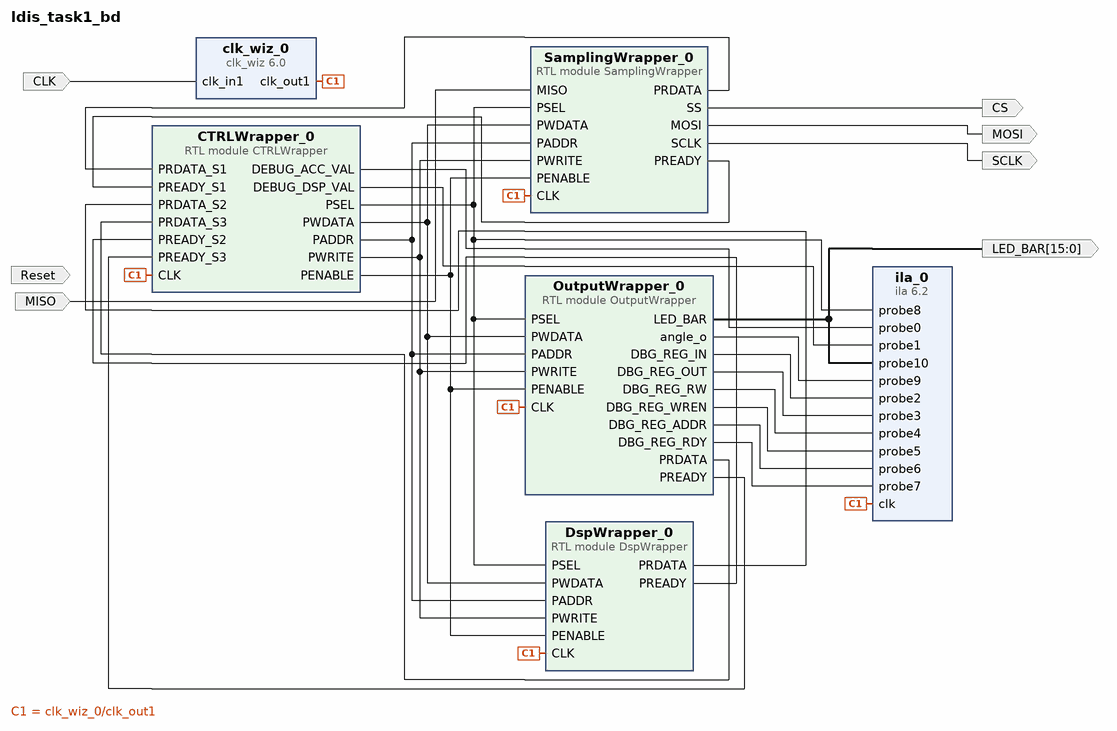
[diagram p0: block diagram of the top level]
# Vivado block design ldis_task1_bd, xc7a100tcsg324-1, Vivado 2018.3
create_bd_design ldis_task1_bd

create_bd_port -dir I -type clk CLK
create_bd_port -dir O MOSI
create_bd_port -dir I MISO
create_bd_port -dir O SCLK
create_bd_port -dir I -type rst Reset
create_bd_port -dir O -type data CS
create_bd_port -dir O -from 15 -to 0 -type data LED_BAR

create_bd_cell -type ip -vlnv xilinx.com:ip:clk_wiz:6.0 clk_wiz_0
set_property -dict [list \
  CONFIG.CLKIN2_JITTER_PS 112.49000000000001 \
  CONFIG.CLKOUT1_DRIVES BUFGCE \
  CONFIG.CLKOUT1_JITTER 203.457 \
  CONFIG.CLKOUT1_PHASE_ERROR 155.540 \
  CONFIG.CLKOUT1_REQUESTED_OUT_FREQ 50 \
  CONFIG.CLKOUT2_DRIVES BUFGCE \
  CONFIG.CLKOUT3_DRIVES BUFGCE \
  CONFIG.CLKOUT4_DRIVES BUFGCE \
  CONFIG.CLKOUT5_DRIVES BUFGCE \
  CONFIG.CLKOUT6_DRIVES BUFGCE \
  CONFIG.CLKOUT7_DRIVES BUFGCE \
  CONFIG.CLK_IN1_BOARD_INTERFACE sys_clock \
  CONFIG.FEEDBACK_SOURCE FDBK_AUTO \
  CONFIG.MMCM_CLKFBOUT_MULT_F 17 \
  CONFIG.MMCM_CLKIN2_PERIOD 10.000 \
  CONFIG.MMCM_CLKOUT0_DIVIDE_F 17 \
  CONFIG.MMCM_COMPENSATION ZHOLD \
  CONFIG.MMCM_DIVCLK_DIVIDE 2 \
  CONFIG.PRIMITIVE PLL \
  CONFIG.SECONDARY_SOURCE Single_ended_clock_capable_pin \
  CONFIG.USE_INCLK_SWITCHOVER false \
  CONFIG.USE_LOCKED false \
  CONFIG.USE_RESET false \
  CONFIG.USE_SAFE_CLOCK_STARTUP true \
] [get_bd_cells clk_wiz_0]
create_bd_cell -type ip -vlnv xilinx.com:ip:ila:6.2 ila_0
set_property -dict [list \
  CONFIG.ALL_PROBE_SAME_MU_CNT 2 \
  CONFIG.C_ADV_TRIGGER true \
  CONFIG.C_ENABLE_ILA_AXI_MON false \
  CONFIG.C_EN_STRG_QUAL 1 \
  CONFIG.C_MONITOR_TYPE Native \
  CONFIG.C_NUM_OF_PROBES 11 \
  CONFIG.C_PROBE0_MU_CNT 2 \
  CONFIG.C_PROBE0_WIDTH 32 \
  CONFIG.C_PROBE10_MU_CNT 2 \
  CONFIG.C_PROBE10_WIDTH 16 \
  CONFIG.C_PROBE1_MU_CNT 2 \
  CONFIG.C_PROBE1_WIDTH 32 \
  CONFIG.C_PROBE2_MU_CNT 2 \
  CONFIG.C_PROBE2_WIDTH 32 \
  CONFIG.C_PROBE3_MU_CNT 2 \
  CONFIG.C_PROBE3_WIDTH 32 \
  CONFIG.C_PROBE4_MU_CNT 2 \
  CONFIG.C_PROBE5_MU_CNT 2 \
  CONFIG.C_PROBE6_MU_CNT 2 \
  CONFIG.C_PROBE6_WIDTH 3 \
  CONFIG.C_PROBE7_MU_CNT 2 \
  CONFIG.C_PROBE8_MU_CNT 2 \
  CONFIG.C_PROBE8_WIDTH 4 \
  CONFIG.C_PROBE9_MU_CNT 2 \
  CONFIG.C_PROBE9_WIDTH 14 \
] [get_bd_cells ila_0]
create_bd_cell -type module -reference CTRLWrapper CTRLWrapper_0
set_property -dict {CONFIG.slaveCount 4} [get_bd_cells CTRLWrapper_0]
create_bd_cell -type module -reference SamplingWrapper SamplingWrapper_0
set_property -dict {CONFIG.slaveCount 4} [get_bd_cells SamplingWrapper_0]
create_bd_cell -type module -reference DspWrapper DspWrapper_0
set_property -dict {CONFIG.pindex 1} [get_bd_cells DspWrapper_0]
create_bd_cell -type module -reference OutputWrapper OutputWrapper_0
set_property -dict {CONFIG.pindex 2} [get_bd_cells OutputWrapper_0]

# ---- connections ----

connect_bd_net [get_bd_ports CLK] [get_bd_pins clk_wiz_0/clk_in1]
connect_bd_net [get_bd_pins clk_wiz_0/clk_out1] \
  [get_bd_pins ila_0/clk] [get_bd_pins CTRLWrapper_0/CLK] [get_bd_pins SamplingWrapper_0/CLK] [get_bd_pins DspWrapper_0/CLK] \
  [get_bd_pins OutputWrapper_0/CLK]
connect_bd_net [get_bd_pins SamplingWrapper_0/SCLK] [get_bd_ports SCLK]
connect_bd_net [get_bd_pins SamplingWrapper_0/MOSI] [get_bd_ports MOSI]
connect_bd_net [get_bd_pins SamplingWrapper_0/SS] [get_bd_ports CS]
connect_bd_net [get_bd_ports MISO] [get_bd_pins SamplingWrapper_0/MISO]
connect_bd_net [get_bd_pins CTRLWrapper_0/PWDATA] \
  [get_bd_pins SamplingWrapper_0/PWDATA] [get_bd_pins DspWrapper_0/PWDATA] [get_bd_pins OutputWrapper_0/PWDATA]
connect_bd_net [get_bd_pins CTRLWrapper_0/PADDR] \
  [get_bd_pins SamplingWrapper_0/PADDR] [get_bd_pins DspWrapper_0/PADDR] [get_bd_pins OutputWrapper_0/PADDR]
connect_bd_net [get_bd_pins CTRLWrapper_0/PWRITE] \
  [get_bd_pins SamplingWrapper_0/PWRITE] [get_bd_pins DspWrapper_0/PWRITE] [get_bd_pins OutputWrapper_0/PWRITE]
connect_bd_net [get_bd_pins CTRLWrapper_0/PSEL] \
  [get_bd_pins ila_0/probe8] [get_bd_pins SamplingWrapper_0/PSEL] [get_bd_pins DspWrapper_0/PSEL] \
  [get_bd_pins OutputWrapper_0/PSEL]
connect_bd_net [get_bd_pins CTRLWrapper_0/PENABLE] \
  [get_bd_pins SamplingWrapper_0/PENABLE] [get_bd_pins DspWrapper_0/PENABLE] [get_bd_pins OutputWrapper_0/PENABLE]
connect_bd_net [get_bd_pins SamplingWrapper_0/PRDATA] [get_bd_pins CTRLWrapper_0/PRDATA_S1]
connect_bd_net [get_bd_pins DspWrapper_0/PRDATA] [get_bd_pins CTRLWrapper_0/PRDATA_S2]
connect_bd_net [get_bd_pins CTRLWrapper_0/DEBUG_ACC_VAL] [get_bd_pins ila_0/probe0]
connect_bd_net [get_bd_pins CTRLWrapper_0/DEBUG_DSP_VAL] [get_bd_pins ila_0/probe1]
connect_bd_net [get_bd_pins DspWrapper_0/PREADY] [get_bd_pins CTRLWrapper_0/PREADY_S2]
connect_bd_net [get_bd_pins SamplingWrapper_0/PREADY] [get_bd_pins CTRLWrapper_0/PREADY_S1]
connect_bd_net [get_bd_pins OutputWrapper_0/LED_BAR] [get_bd_ports LED_BAR] [get_bd_pins ila_0/probe10]
connect_bd_net [get_bd_pins OutputWrapper_0/PRDATA] [get_bd_pins CTRLWrapper_0/PRDATA_S3]
connect_bd_net [get_bd_pins OutputWrapper_0/PREADY] [get_bd_pins CTRLWrapper_0/PREADY_S3]
connect_bd_net [get_bd_pins OutputWrapper_0/angle_o] [get_bd_pins ila_0/probe9]
connect_bd_net [get_bd_pins OutputWrapper_0/DBG_REG_IN] [get_bd_pins ila_0/probe2]
connect_bd_net [get_bd_pins OutputWrapper_0/DBG_REG_OUT] [get_bd_pins ila_0/probe3]
connect_bd_net [get_bd_pins OutputWrapper_0/DBG_REG_RW] [get_bd_pins ila_0/probe4]
connect_bd_net [get_bd_pins OutputWrapper_0/DBG_REG_WREN] [get_bd_pins ila_0/probe5]
connect_bd_net [get_bd_pins OutputWrapper_0/DBG_REG_ADDR] [get_bd_pins ila_0/probe6]
connect_bd_net [get_bd_pins OutputWrapper_0/DBG_REG_RDY] [get_bd_pins ila_0/probe7]

validate_bd_design
save_bd_design
